# Altium schematic sheet Schematic.schdoc
size 278 x 168 mm
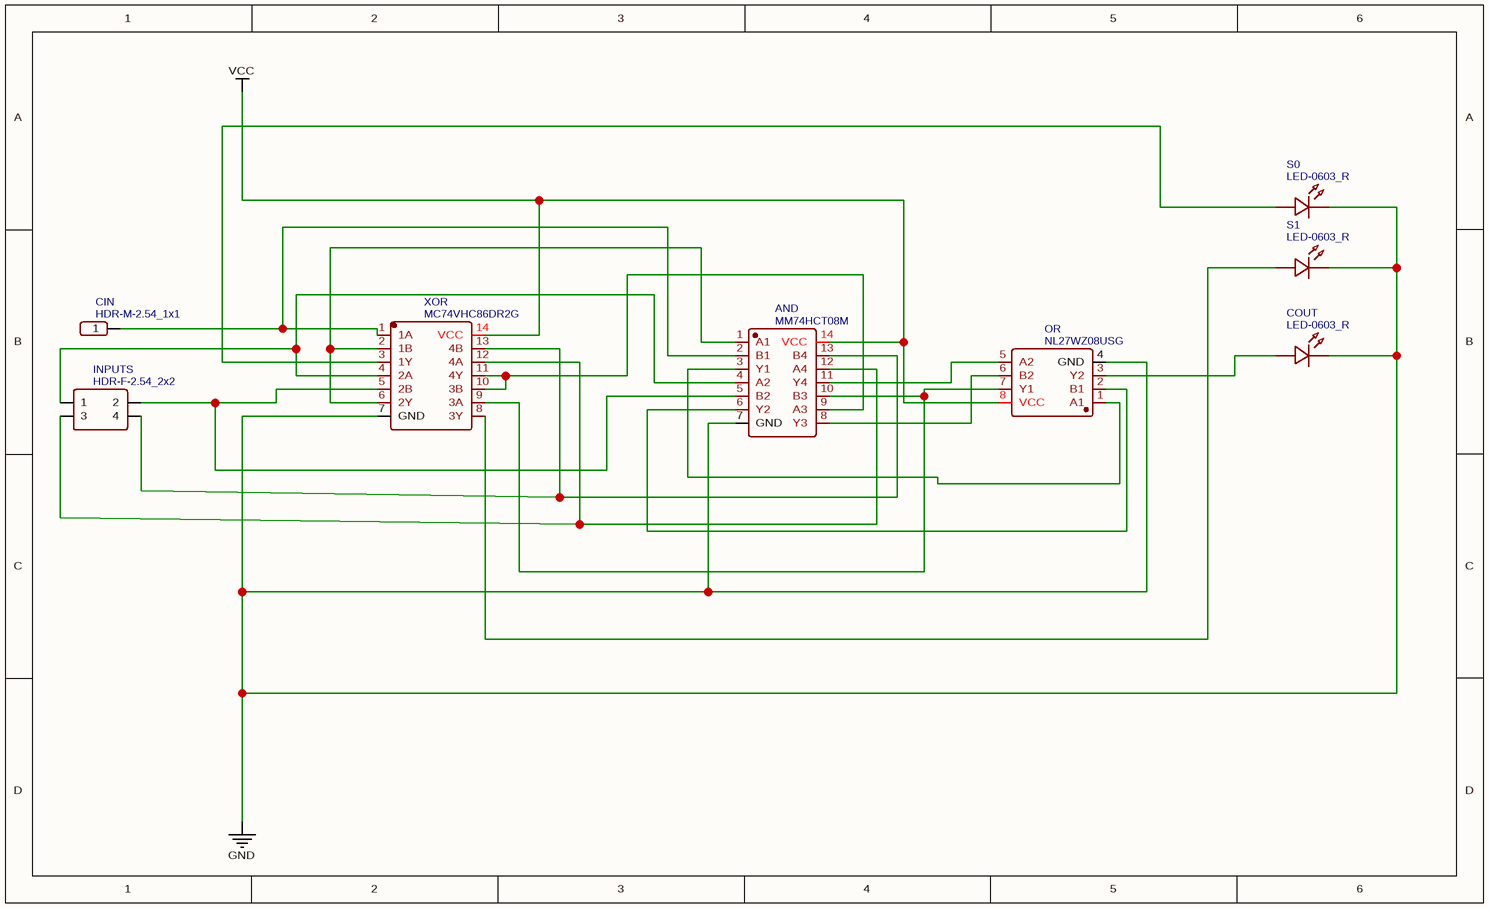
[diagram p0: Schematic.schdoc]

## Parts
AND  MM74HCT08M  [SOIC-14_L8.7-W3.9-P1.27-LS6.0-BL]
CIN  HDR-M-2.54_1x1  [HDR-M-2.54_1X1]
COUT  LED-0603_R  [LED0603_RED]
INPUTS  HDR-F-2.54_2x2  [HDR-F-2.54_2X2]
OR  NL27WZ08USG  [VSSOP-8_L2.1-W2.4-P0.50-LS3.2-BR]
S0  LED-0603_R  [LED0603_RED]
S1  LED-0603_R  [LED0603_RED]
XOR  MC74VHC86DR2G  [SOIC-14_L8.7-W3.9-P1.27-LS6.0-BL]

## Nets
GND: AND.7(GND) COUT.2 OR.4(GND) S0.2 S1.2 XOR.7(GND)
VCC: AND.14(VCC) OR.8(VCC) XOR.14(VCC)
NetAND_1: AND.1(A1) XOR.2(1B) XOR.6(2Y)
NetAND_2: AND.2(B1) CIN.1 XOR.1(1A)
NetAND_3: AND.3(Y1) OR.1(A1)
NetAND_4: AND.4(A2) INPUTS.1 XOR.4(2A)
NetAND_5: AND.5(B2) INPUTS.2 XOR.5(2B)
NetAND_6: AND.6(Y2) OR.2(B1)
NetAND_8: AND.8(Y3) OR.6(B2)
NetAND_9: AND.9(A3) XOR.10(3B) XOR.11(4Y)
NetAND_10: AND.10(B3) OR.7(Y1) XOR.9(3A)
NetAND_11: AND.11(Y4) OR.5(A2)
NetAND_12: AND.12(A4) INPUTS.3 XOR.12(4A)
NetAND_13: AND.13(B4) INPUTS.4 XOR.13(4B)
NetCOUT_1: COUT.1 OR.3(Y2)
NetS0_1: S0.1 XOR.3(1Y)
NetS1_1: S1.1 XOR.8(3Y)

## Library data of the parts
AND = MM74HCT08M: BOM_Manufacturer: onsemi(安森美); Contributor: LCSC; BOM_Supplier: LCSC; BOM_Supplier Part: C900098; BOM_Manufacturer Part: MM74HCT08M; BOM_JLCPCB Part Class: Extended Part; spicePre: U; spiceSymbolName: MM74HCT08M
CIN = HDR-M-2.54_1x1: Contributor: LCEDA_Lib; BOM_Supplier Part: C81276; BOM_Supplier: LCSC; spicePre: J; spiceSymbolName: HDR-M-2.54_1x1
COUT S0 S1 = LED-0603_R: BOM_Manufacturer: EVERLIGHT(台湾亿光); BOM_Manufacturer Part: 19-217/R6C-AL1M2VY/3T; Contributor: LCEDA_01; BOM_Supplier Part: C72044; BOM_Supplier: LCSC; spicePre: L; spiceSymbolName: LED-0603_R
INPUTS = HDR-F-2.54_2x2: Contributor: LCEDA_Lib; BOM_Supplier Part: C239342; BOM_Supplier: LCSC; spicePre: H; spiceSymbolName: HDR-F-2.54_2x2
OR = NL27WZ08USG: BOM_Manufacturer: onsemi(安森美); Contributor: LCSC; BOM_Supplier: LCSC; BOM_Supplier Part: C209702; BOM_Manufacturer Part: NL27WZ08USG; BOM_JLCPCB Part Class: Extended Part; spicePre: U; spiceSymbolName: NL27WZ08USG
XOR = MC74VHC86DR2G: BOM_Manufacturer: onsemi(安森美); Contributor: LCSC; BOM_Supplier: LCSC; BOM_Supplier Part: C233551; BOM_Manufacturer Part: MC74VHC86DR2G; BOM_JLCPCB Part Class: Extended Part; spicePre: U; spiceSymbolName: MC74VHC86DR2G